# EAGLE design dcMotor (EAGLE 5.10)
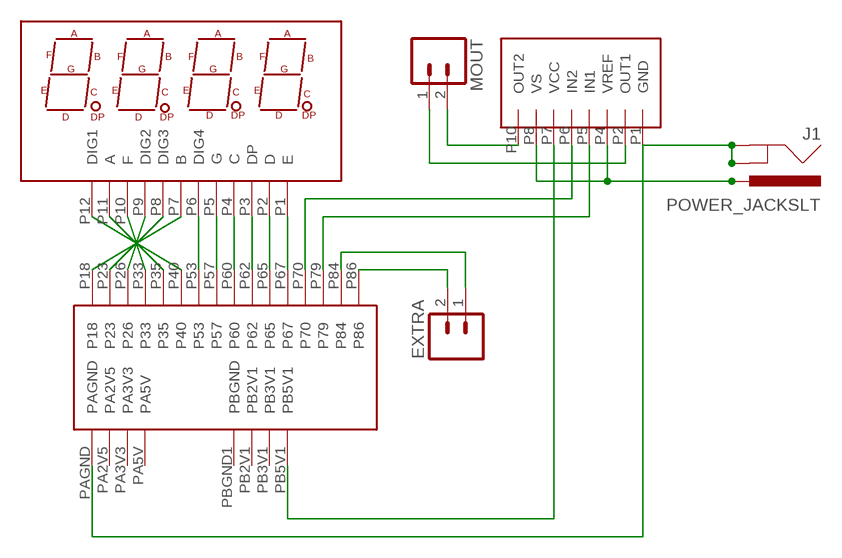
[diagram p0: schematic, sheet 1]

## Parts
EXTRA  M02PTH  [1X02]
J1  POWER_JACKSLT  [POWER_JACK_SLOT]
MOUT  M02PTH  [1X02]
TA7291P  TA7291P  [TA7291P]
U$2  7-SEGMENT-4DIGIT-YOUNGSUNQUAD-7SEG-12PIN  [7-SEGMENT-4DIGIT-YOUNGSUN]
U$3  M16  [1X16]

## Nets
GND: J1.GND@1(GNDBREAK) J1.GND@2(GND) TA7291P.P1(GND) U$3.PAGND
N$1: U$2.P7(B) U$3.P18
N$2: MOUT.2 TA7291P.P10(OUT2)
N$3: MOUT.1 TA7291P.P2(OUT1)
N$4: TA7291P.P6(IN2) U$3.P70
N$5: TA7291P.P5(IN1) U$3.P79
N$6: TA7291P.P7(VCC) U$3.PB5V1
N$7: J1.PWR TA7291P.P4(VREF) TA7291P.P8(VS)
N$8: U$2.P8(DIG3) U$3.P23
N$9: U$2.P9(DIG2) U$3.P26
N$10: U$2.P10(F) U$3.P33
N$11: U$2.P11(A) U$3.P35
N$12: U$2.P12(DIG1) U$3.P40
N$13: U$2.P6(DIG4) U$3.P53
N$14: U$2.P5(G) U$3.P57
N$15: U$2.P4(C) U$3.P60
N$16: U$2.P3(DP) U$3.P62
N$17: U$2.P2(D) U$3.P65
N$18: U$2.P1(E) U$3.P67
N$19: EXTRA.2 U$3.P86
N$20: EXTRA.1 U$3.P84

## Power pins joined to a net without a drawn wire
PA2V5: U$3.PA2V5
PA3V3: U$3.PA3V3
PA5V: U$3.PA5V
PB2V1: U$3.PB2V1
PB3V1: U$3.PB3V1
PBGND: U$3.PBGND1(PBGND)

## Library data of the parts
EXTRA MOUT = _Robin:M02: Header 2 Standard 2-pin 0.1" header. Use with straight break away headers (SKU : PRT-00116), right angle break away headers (PRT-00553), swiss pins (PRT-00743), machine pins (PRT-00117), and female headers (PRT-00115). Molex polarized connector foot print use with SKU : PRT-08233 with associated crimp pins and housings.
J1 = SparkFun:POWER_JACK: Power Jack This is the standard 5.5mm barrel jack for power. The PTH is the most common, proven, reliable, footprint. All others are experimental. The Slot footprint only works if the mill layer is transmitted to the PCB fab house so be warned. Spark Fun Electronics SKU : PRT-00119. Mating wall wart : TOL-00298 (and others)
TA7291P = _Robin:TA7291P: TA7291P DC Motor Controller
U$2 = _Robin:7-SEGMENT-4DIGIT-YOUNGSUN: quad 7seg 12pin
U$3 = _Robin:M16: Papilio Wing A

## Net classes
0 default: width 0.406 mm, drill 0.025 mm, clearance 0.025 mm

## Board
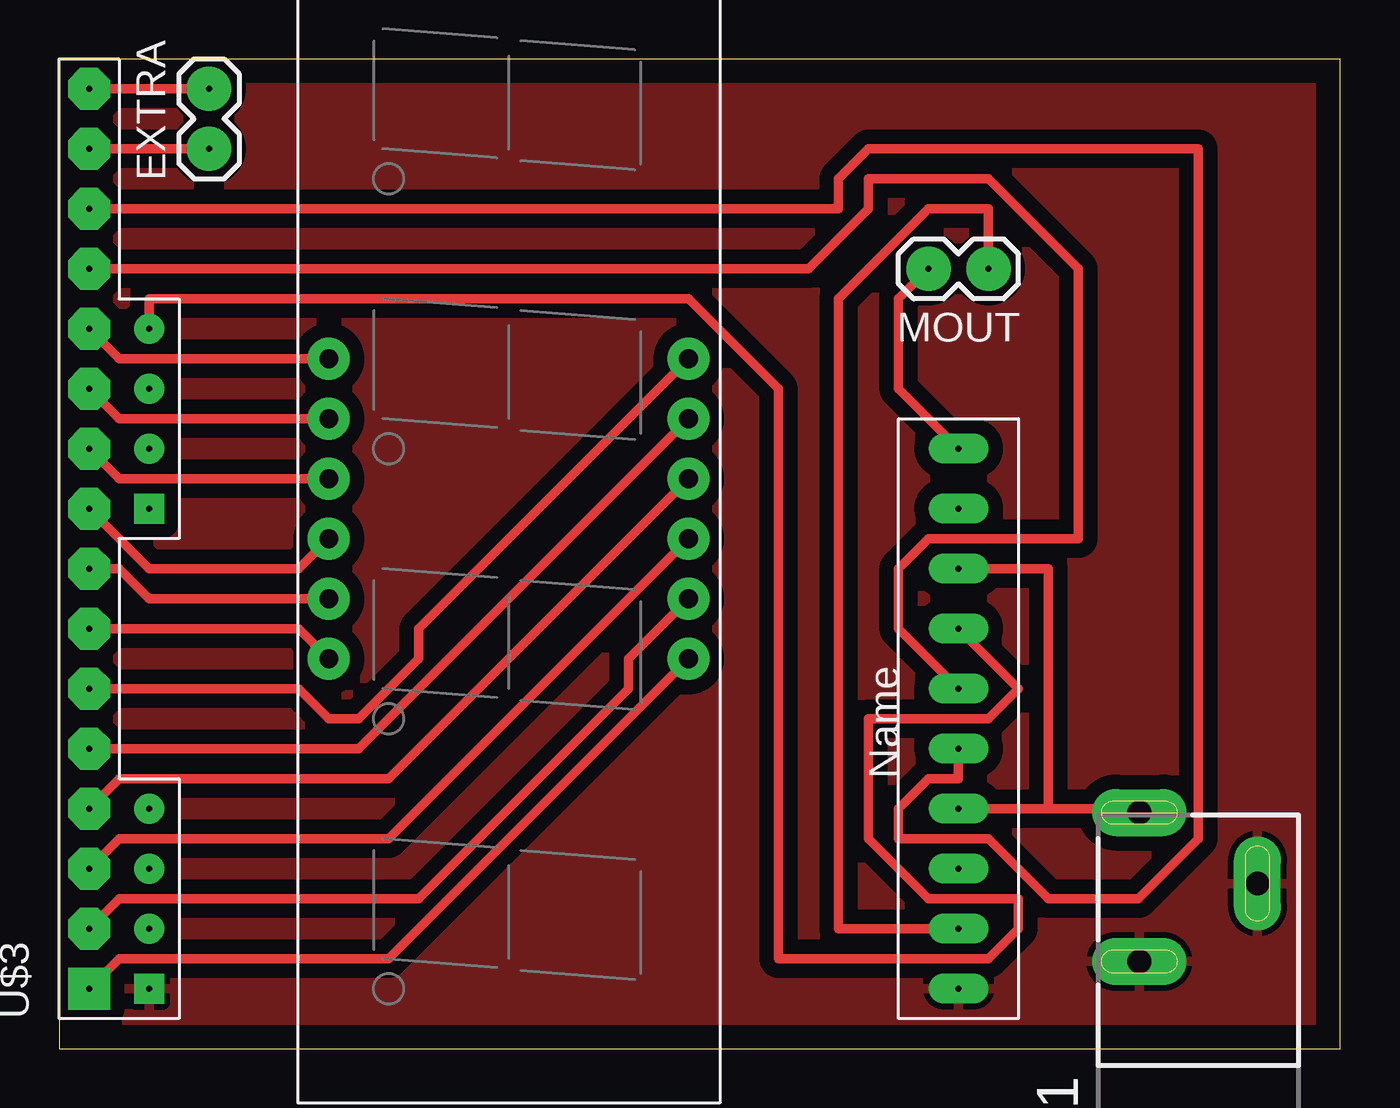
[diagram p1: board, top side]

Size 54.28 x 41.9 mm. Coordinates in mm from the lower left corner, seen from the top.
Outline: 0,0 54.28,0 54.28,41.9 0,41.9 0,0
Copper layers (1*16): Top 0.035mm / dielectric 1.5mm / Bottom 0.035mm
Design rules "default": minimum track width 10mil, minimum drill 24mil, track to track 8mil, track to pad 8mil, pad to pad 8mil, via to via 8mil, smd to smd 8mil, copper to edge 40mil, drill to drill 8mil, minimum pad ring 10mil, minimum via ring 8mil, stop-mask expansion 4mil, vias tented up to drill 0mil, thermal gap 10mil

### Footprints (pad centres in the part's own frame; a part is rotated, then mirrored left to right if it is on the bottom)
1X02 = drill 0.254 pad 1.88 round: 1 0,0; 2 2.54,0
POWER_JACK_SLOT = drill 1 pad 2 long: GND@1 2.58,7.5; GND@2 7.58,10.8; PWR 2.58,13.8
TA7291P = drill 0.254 pad 1.27 long: P1 -11.43,0; P2 -8.89,0; P3 -6.35,0; P4 -3.81,0; P5 -1.27,0; P6 1.27,0; P7 3.81,0; P8 6.35,0; P9 8.89,0; P10 11.43,0
7-SEGMENT-4DIGIT-YOUNGSUN = drill 0.8 pad 1.778 round: P1 -6.35,-8.89; P2 -3.81,-8.89; P3 -1.27,-8.89; P4 1.27,-8.89; P5 3.81,-8.89; P6 6.35,-8.89; P7 6.35,6.35; P8 3.81,6.35; P9 1.27,6.35; P10 -1.27,6.35; P11 -3.81,6.35; P12 -6.35,6.35
1X16 = drill 0.254 pad 1.778 square: P18 -19.05,0 | drill 0.254 pad 1.778 octagon: P23 -16.51,0; P26 -13.97,0; P33 -11.43,0; P35 -8.89,0; P40 -6.35,0; P53 -3.81,0; P57 -1.27,0; P60 1.27,0; P62 3.81,0; P65 6.35,0; P67 8.89,0; P70 11.43,0; P79 13.97,0; P84 16.51,0; P86 19.05,0 | drill 0.254 pad 1.27 round: PA2V5 -16.51,-2.54; PA3V3 -13.97,-2.54; PA5V -11.43,-2.54; PB2V1 3.81,-2.54; PB3V1 6.35,-2.54; PB5V1 8.89,-2.54 | drill 0.254 pad 1.27 square: PAGND -19.05,-2.54; PBGND1 1.27,-2.54

### Placement (x,y rotation side)
EXTRA  6.35,38.1 90 top
J1  43.18,-3.81 0 top
MOUT  39.37,33.02 180 top
TA7291P  38.1,13.97 90 top
U$2  20.32,22.86 270 top
U$3  1.27,21.59 90 top

### Tracks (layer width: path | path; a pad name or v marks a point on that pad's centre or on a via)
GND
  pour Top (isolate 0.61): 0,41.91 54.61,41.91 54.61,0 0,0
N$1
  Top 0.406: U$3.P18 2.54,3.81 13.97,3.81 U$2.P7
N$2
  Top 0.406: TA7291P.P10 35.56,27.94 35.56,31.75 MOUT.2
N$3
  Top 0.406: TA7291P.P2 33.02,5.08 33.02,31.75 36.83,35.56 39.37,35.56 MOUT.1
N$4
  Top 0.406: TA7291P.P6 35.56,17.78 35.56,20.32 36.83,21.59 43.18,21.59 43.18,33.02 39.37,36.83 34.29,36.83 34.29,35.56 31.75,33.02 U$3.P70
N$5
  Top 0.406: U$3.P79 33.02,35.56 33.02,36.83 34.29,38.1 48.26,38.1 48.26,8.89 45.72,6.35 41.91,6.35 39.37,8.89 35.56,8.89 35.56,10.16 36.83,11.43 38.1,11.43 TA7291P.P5
N$6
  Top 0.406: TA7291P.P7 40.64,15.24 39.37,13.97 34.29,13.97 34.29,8.89 36.83,6.35 40.64,6.35 40.64,5.08 39.37,3.81 30.48,3.81 30.48,27.94 26.67,31.75 3.81,31.75 U$3.PB5V1
N$7
  Top 0.406: 41.91,10.16 45.72,10.16 J1.PWR | TA7291P.P4 41.91,10.16 | TA7291P.P8 41.91,20.32 41.91,10.16
N$8
  Top 0.406: U$3.P23 2.54,6.35 15.24,6.35 24.13,15.24 24.13,16.51 U$2.P8
N$9
  Top 0.406: U$3.P26 2.54,8.89 13.97,8.89 U$2.P9
N$10
  Top 0.406: U$3.P33 2.54,11.43 13.97,11.43 U$2.P10
N$11
  Top 0.406: U$2.P11 12.7,12.7 U$3.P35
N$12
  Top 0.406: U$3.P40 10.16,15.24 11.43,13.97 12.7,13.97 15.24,16.51 15.24,17.78 U$2.P12
N$13
  Top 0.406: U$3.P53 10.16,17.78 U$2.P6
N$14
  Top 0.406: U$3.P57 2.54,20.32 3.81,19.05 U$2.P5
N$15
  Top 0.406: U$3.P60 3.81,20.32 10.16,20.32 U$2.P4
N$16
  Top 0.406: U$3.P62 2.54,24.13 U$2.P3
N$17
  Top 0.406: U$3.P65 2.54,26.67 U$2.P2
N$18
  Top 0.406: U$3.P67 2.54,29.21 U$2.P1
N$19
  Top 0.406: U$3.P86 EXTRA.2
N$20
  Top 0.406: U$3.P84 EXTRA.1